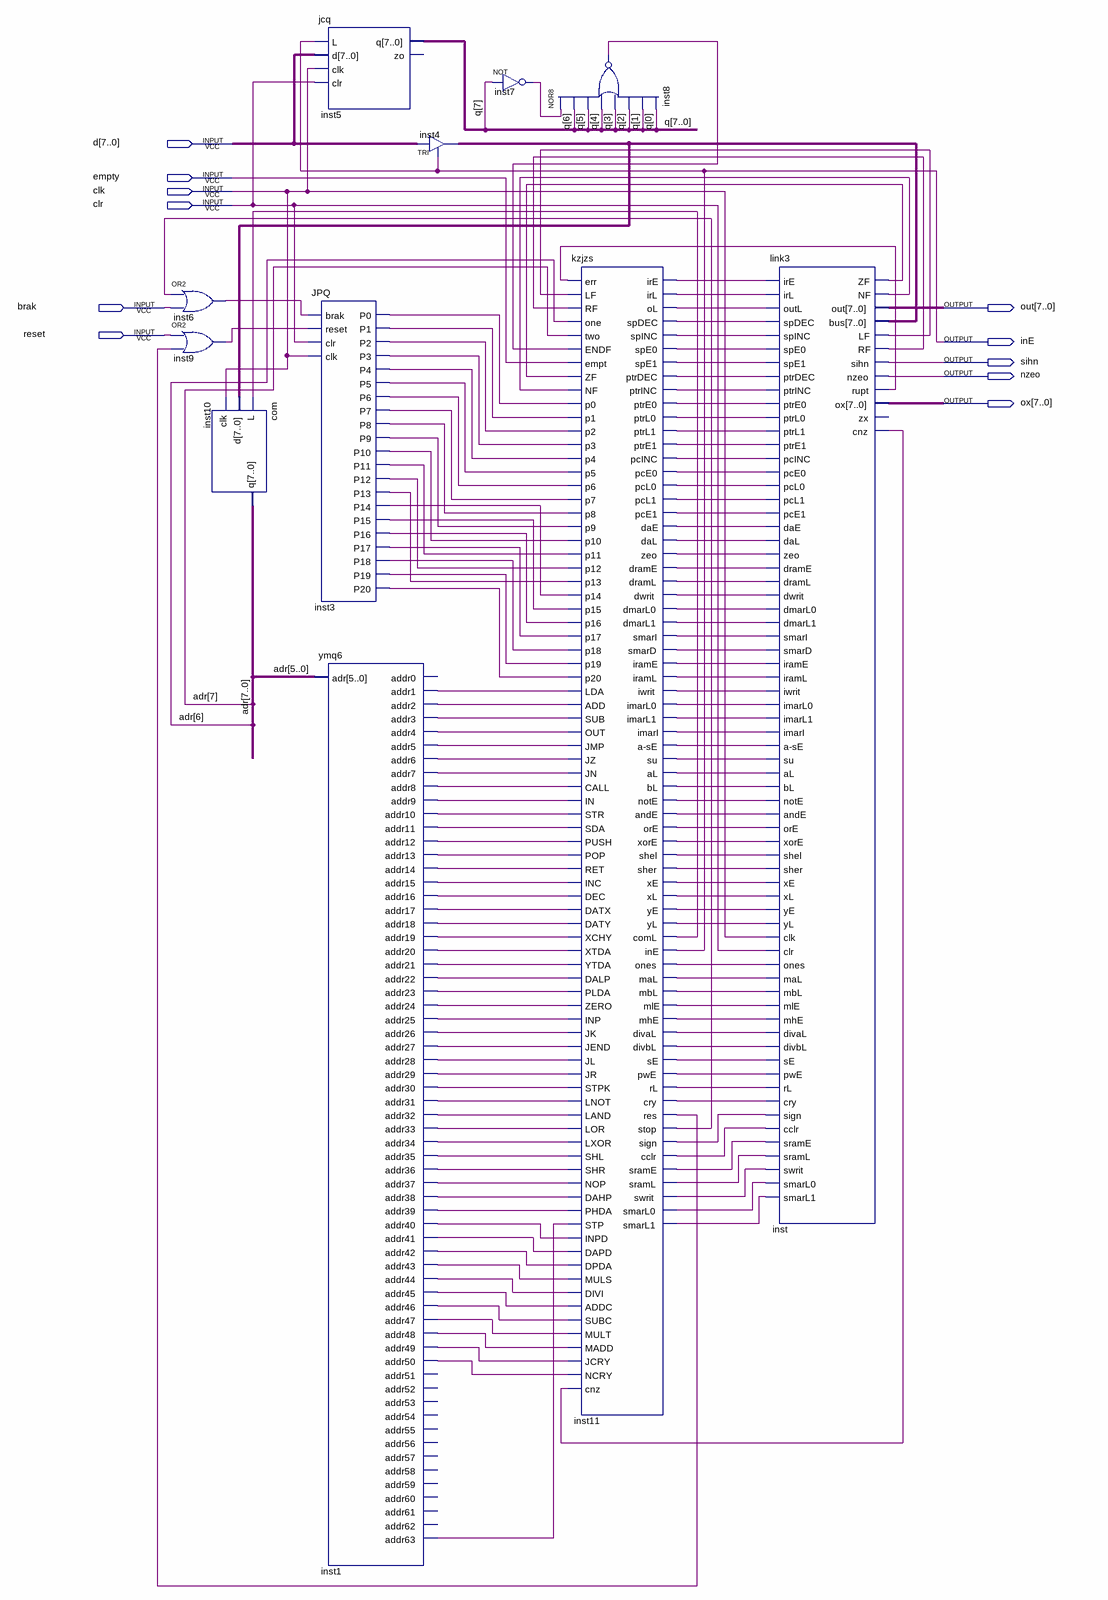
[diagram p0: schematic sheet]
// Quartus schematic top.bdf as structural Verilog: 11 symbols, 11 pins
module top (
  input  [7:0] d,
  input  empty,
  input  clk,
  input  clr,
  input  brak,
  input  reset,
  output [7:0] out,
  output inE,
  output sihn,
  output nzeo,
  output [7:0] ox
);

  wire inst1_addr1, inst1_addr2, inst1_addr3, inst1_addr4, inst1_addr5, inst1_addr6, inst1_addr7,
       inst1_addr8, inst1_addr9, inst1_addr10, inst1_addr11, inst1_addr12, inst1_addr13, inst1_addr14,
       inst1_addr15, inst1_addr16, inst1_addr17, inst1_addr18, inst1_addr19, inst1_addr20, inst1_addr21,
       inst1_addr22, inst1_addr23, inst1_addr24, inst1_addr25, inst1_addr26, inst1_addr27, inst1_addr28,
       inst1_addr29, inst1_addr30, inst1_addr31, inst1_addr32, inst1_addr33, inst1_addr34, inst1_addr35,
       inst1_addr36, inst1_addr37, inst1_addr38, inst1_addr39, inst1_addr40, inst1_addr41, inst1_addr42,
       inst1_addr43, inst1_addr44, inst1_addr45, inst1_addr46, inst1_addr47, inst1_addr48, inst1_addr49,
       inst1_addr50, inst1_addr63, inst3_p0, inst3_p1, inst3_p2, inst3_p3, inst3_p4, inst3_p5, inst3_p6,
       inst3_p7, inst3_p8, inst3_p9, inst3_p10, inst3_p11, inst3_p12, inst3_p13, inst3_p14, inst3_p15,
       inst3_p16, inst3_p17, inst3_p18, inst3_p19, inst3_p20, inst6_out, inst7_out, inst8_out, inst9_out,
       inst11_a_se, inst11_al, inst11_ande, inst11_bl, inst11_cclr, inst11_coml, inst11_cry, inst11_dae,
       inst11_dal, inst11_dival, inst11_divbl, inst11_dmarl0, inst11_dmarl1, inst11_drame, inst11_draml,
       inst11_dwrit, inst11_imari, inst11_imarl0, inst11_imarl1, inst11_irame, inst11_iraml, inst11_ire,
       inst11_irl, inst11_iwrit, inst11_mal, inst11_mbl, inst11_mhe, inst11_mle, inst11_note, inst11_ol,
       inst11_ones, inst11_ore, inst11_pce0, inst11_pce1, inst11_pcinc, inst11_pcl0, inst11_pcl1,
       inst11_ptrdec, inst11_ptre0, inst11_ptre1, inst11_ptrinc, inst11_ptrl0, inst11_ptrl1, inst11_pwe,
       inst11_res, inst11_rl, inst11_se, inst11_shel, inst11_sher, inst11_sign, inst11_smard, inst11_smari,
       inst11_smarl0, inst11_smarl1, inst11_spdec, inst11_spe0, inst11_spe1, inst11_spinc, inst11_srame,
       inst11_sraml, inst11_stop, inst11_su, inst11_swrit, inst11_xe, inst11_xl, inst11_xore, inst11_ye,
       inst11_yl, inst11_zeo, inst_cnz, inst_lf, inst_nf, inst_rf, inst_rupt, inst_zf;
  wire [7:0] adr, inst4_out, q;

  or inst6 (inst6_out, inst11_stop, brak);
  or inst9 (inst9_out, reset, inst11_res);
  com inst10 (.L(inst11_coml), .d(inst4_out), .clk(clk), .q(adr));
  JPQ inst3 (
    .brak(inst6_out), .reset(inst9_out), .clr(clr), .clk(clk), .P0(inst3_p0), .P1(inst3_p1), .P2(inst3_p2),
    .P3(inst3_p3), .P4(inst3_p4), .P5(inst3_p5), .P6(inst3_p6), .P7(inst3_p7), .P8(inst3_p8), .P9(inst3_p9),
    .P10(inst3_p10), .P11(inst3_p11), .P12(inst3_p12), .P13(inst3_p13), .P14(inst3_p14), .P15(inst3_p15),
    .P16(inst3_p16), .P17(inst3_p17), .P18(inst3_p18), .P19(inst3_p19), .P20(inst3_p20));
  jcq inst5 (.L(inE), .d(d), .clk(clk), .clr(clr), .q(q));  // open: zo
  ymq6 inst1 (
    .adr(adr[5:0]), .addr1(inst1_addr1), .addr2(inst1_addr2), .addr3(inst1_addr3), .addr4(inst1_addr4),
    .addr5(inst1_addr5), .addr6(inst1_addr6), .addr7(inst1_addr7), .addr8(inst1_addr8), .addr9(inst1_addr9),
    .addr10(inst1_addr10), .addr11(inst1_addr11), .addr12(inst1_addr12), .addr13(inst1_addr13),
    .addr14(inst1_addr14), .addr15(inst1_addr15), .addr16(inst1_addr16), .addr17(inst1_addr17),
    .addr18(inst1_addr18), .addr19(inst1_addr19), .addr20(inst1_addr20), .addr21(inst1_addr21),
    .addr22(inst1_addr22), .addr23(inst1_addr23), .addr24(inst1_addr24), .addr25(inst1_addr25),
    .addr26(inst1_addr26), .addr27(inst1_addr27), .addr28(inst1_addr28), .addr29(inst1_addr29),
    .addr30(inst1_addr30), .addr31(inst1_addr31), .addr32(inst1_addr32), .addr33(inst1_addr33),
    .addr34(inst1_addr34), .addr35(inst1_addr35), .addr36(inst1_addr36), .addr37(inst1_addr37),
    .addr38(inst1_addr38), .addr39(inst1_addr39), .addr40(inst1_addr40), .addr41(inst1_addr41),
    .addr42(inst1_addr42), .addr43(inst1_addr43), .addr44(inst1_addr44), .addr45(inst1_addr45),
    .addr46(inst1_addr46), .addr47(inst1_addr47), .addr48(inst1_addr48), .addr49(inst1_addr49),
    .addr50(inst1_addr50), .addr63(inst1_addr63));  // open: addr0, addr51, addr52, addr53, addr54, addr55, addr56, addr57, addr58, addr59, addr60, addr61, addr62
  TRI inst4[7:0] (.IN(d), .OE(inE), .OUT(inst4_out));
  not inst7 (inst7_out, q[7]);
  nor inst8 (inst8_out, inst7_out, q[6], q[5], q[4], q[3], q[2], q[1], q[0]);
  kzjzs inst11 (
    .err(inst_rupt), .LF(inst_lf), .RF(inst_rf), .one(adr[6]), .two(adr[7]), .ENDF(inst8_out), .empt(empty),
    .ZF(inst_zf), .NF(inst_nf), .p0(inst3_p0), .p1(inst3_p1), .p2(inst3_p2), .p3(inst3_p3), .p4(inst3_p4),
    .p5(inst3_p5), .p6(inst3_p6), .p7(inst3_p7), .p8(inst3_p8), .p9(inst3_p9), .p10(inst3_p10),
    .p11(inst3_p11), .p12(inst3_p12), .p13(inst3_p13), .p14(inst3_p14), .p15(inst3_p15), .p16(inst3_p16),
    .p17(inst3_p17), .p18(inst3_p18), .p19(inst3_p19), .p20(inst3_p20), .LDA(inst1_addr1), .ADD(inst1_addr2),
    .SUB(inst1_addr3), .OUT(inst1_addr4), .JMP(inst1_addr5), .JZ(inst1_addr6), .JN(inst1_addr7),
    .CALL(inst1_addr8), .IN(inst1_addr9), .STR(inst1_addr10), .SDA(inst1_addr11), .PUSH(inst1_addr12),
    .POP(inst1_addr13), .RET(inst1_addr14), .INC(inst1_addr15), .DEC(inst1_addr16), .DATX(inst1_addr17),
    .DATY(inst1_addr18), .XCHY(inst1_addr19), .XTDA(inst1_addr20), .YTDA(inst1_addr21), .DALP(inst1_addr22),
    .PLDA(inst1_addr23), .ZERO(inst1_addr24), .INP(inst1_addr25), .JK(inst1_addr26), .JEND(inst1_addr27),
    .JL(inst1_addr28), .JR(inst1_addr29), .STPK(inst1_addr30), .LNOT(inst1_addr31), .LAND(inst1_addr32),
    .LOR(inst1_addr33), .LXOR(inst1_addr34), .SHL(inst1_addr35), .SHR(inst1_addr36), .NOP(inst1_addr37),
    .DAHP(inst1_addr38), .PHDA(inst1_addr39), .STP(inst1_addr63), .INPD(inst1_addr40), .DAPD(inst1_addr41),
    .DPDA(inst1_addr42), .MULS(inst1_addr43), .DIVI(inst1_addr44), .ADDC(inst1_addr45), .SUBC(inst1_addr46),
    .MULT(inst1_addr47), .MADD(inst1_addr48), .JCRY(inst1_addr49), .NCRY(inst1_addr50), .cnz(inst_cnz),
    .irE(inst11_ire), .irL(inst11_irl), .oL(inst11_ol), .spDEC(inst11_spdec), .spINC(inst11_spinc),
    .spE0(inst11_spe0), .spE1(inst11_spe1), .ptrDEC(inst11_ptrdec), .ptrINC(inst11_ptrinc),
    .ptrE0(inst11_ptre0), .ptrL0(inst11_ptrl0), .ptrL1(inst11_ptrl1), .ptrE1(inst11_ptre1),
    .pcINC(inst11_pcinc), .pcE0(inst11_pce0), .pcL0(inst11_pcl0), .pcL1(inst11_pcl1), .pcE1(inst11_pce1),
    .daE(inst11_dae), .daL(inst11_dal), .zeo(inst11_zeo), .dramE(inst11_drame), .dramL(inst11_draml),
    .dwrit(inst11_dwrit), .dmarL0(inst11_dmarl0), .dmarL1(inst11_dmarl1), .smarI(inst11_smari),
    .smarD(inst11_smard), .iramE(inst11_irame), .iramL(inst11_iraml), .iwrit(inst11_iwrit),
    .imarL0(inst11_imarl0), .imarL1(inst11_imarl1), .imarI(inst11_imari), .\a-sE (inst11_a_se),
    .su(inst11_su), .aL(inst11_al), .bL(inst11_bl), .notE(inst11_note), .andE(inst11_ande), .orE(inst11_ore),
    .xorE(inst11_xore), .shel(inst11_shel), .sher(inst11_sher), .xE(inst11_xe), .xL(inst11_xl),
    .yE(inst11_ye), .yL(inst11_yl), .comL(inst11_coml), .inE(inE), .ones(inst11_ones), .maL(inst11_mal),
    .mbL(inst11_mbl), .mlE(inst11_mle), .mhE(inst11_mhe), .divaL(inst11_dival), .divbL(inst11_divbl),
    .sE(inst11_se), .pwE(inst11_pwe), .rL(inst11_rl), .cry(inst11_cry), .res(inst11_res), .stop(inst11_stop),
    .sign(inst11_sign), .cclr(inst11_cclr), .sramE(inst11_srame), .sramL(inst11_sraml), .swrit(inst11_swrit),
    .smarL0(inst11_smarl0), .smarL1(inst11_smarl1));
  link3 inst (
    .irE(inst11_ire), .irL(inst11_irl), .outL(inst11_ol), .spDEC(inst11_spdec), .spINC(inst11_spinc),
    .spE0(inst11_spe0), .spE1(inst11_spe1), .ptrDEC(inst11_ptrdec), .ptrINC(inst11_ptrinc),
    .ptrE0(inst11_ptre0), .ptrL0(inst11_ptrl0), .ptrL1(inst11_ptrl1), .ptrE1(inst11_ptre1),
    .pcINC(inst11_pcinc), .pcE0(inst11_pce0), .pcL0(inst11_pcl0), .pcL1(inst11_pcl1), .pcE1(inst11_pce1),
    .daE(inst11_dae), .daL(inst11_dal), .zeo(inst11_zeo), .dramE(inst11_drame), .dramL(inst11_draml),
    .dwrit(inst11_dwrit), .dmarL0(inst11_dmarl0), .dmarL1(inst11_dmarl1), .smarI(inst11_smari),
    .smarD(inst11_smard), .iramE(inst11_irame), .iramL(inst11_iraml), .iwrit(inst11_iwrit),
    .imarL0(inst11_imarl0), .imarL1(inst11_imarl1), .imarI(inst11_imari), .\a-sE (inst11_a_se),
    .su(inst11_su), .aL(inst11_al), .bL(inst11_bl), .notE(inst11_note), .andE(inst11_ande), .orE(inst11_ore),
    .xorE(inst11_xore), .shel(inst11_shel), .sher(inst11_sher), .xE(inst11_xe), .xL(inst11_xl),
    .yE(inst11_ye), .yL(inst11_yl), .clk(clk), .clr(clr), .ones(inst11_ones), .maL(inst11_mal),
    .mbL(inst11_mbl), .mlE(inst11_mle), .mhE(inst11_mhe), .divaL(inst11_dival), .divbL(inst11_divbl),
    .sE(inst11_se), .pwE(inst11_pwe), .rL(inst11_rl), .cry(inst11_cry), .sign(inst11_sign),
    .cclr(inst11_cclr), .sramE(inst11_srame), .sramL(inst11_sraml), .swrit(inst11_swrit),
    .smarL0(inst11_smarl0), .smarL1(inst11_smarl1), .ZF(inst_zf), .NF(inst_nf), .out(out), .LF(inst_lf),
    .RF(inst_rf), .sihn(sihn), .nzeo(nzeo), .rupt(inst_rupt), .ox(ox), .cnz(inst_cnz), .bus(inst4_out));  // open: zx
endmodule
